# Altium schematic sheet Mosfet driver.SchDoc
size A4; SheetNumber: 2; SheetTotal: 2
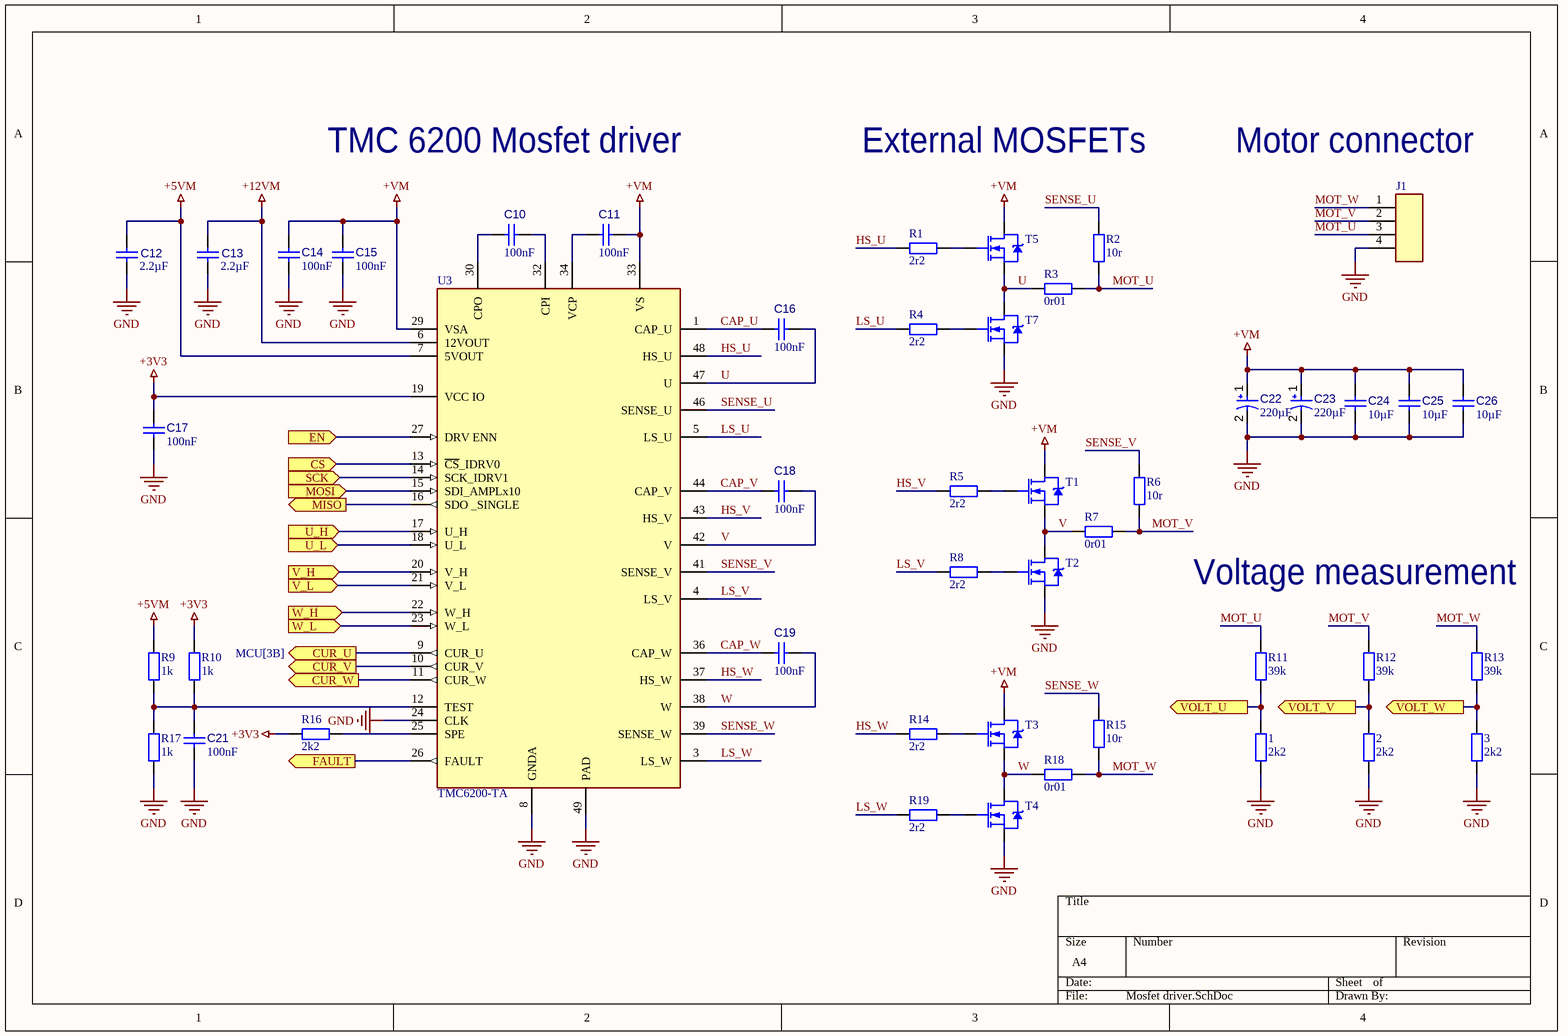
[diagram p0: Mosfet driver.SchDoc]

## Parts
1  value 2k2  [RESC1608X04M]  (hidden comment: R0603)
2  value 2k2  [RESC1608X04M]  (hidden comment: R0603)
3  value 2k2  [RESC1608X04M]  (hidden comment: R0603)
C10  value 100nF  [CAPC1608X90X40NL10T20]  (hidden comment: Capacitor 100 nF +/-10% 50 V 0603)
C11  value 100nF  [CAPC1608X90X40NL10T20]  (hidden comment: Capacitor 100 nF +/-10% 50 V 0603)
C12  value 2.2µF  [CAPC0805(2012)145_L]  (hidden comment: Capacitor 22µF +/-40% 16V 0805)
C13  value 2.2µF  [CAPC0805(2012)145_L]  (hidden comment: Capacitor 22µF +/-40% 16V 0805)
C14  value 100nF  [CAPC1608X90X40NL10T20]  (hidden comment: Capacitor 100 nF +/-10% 50 V 0603)
C15  value 100nF  [CAPC1608X90X40NL10T20]  (hidden comment: Capacitor 100 nF +/-10% 50 V 0603)
C16  value 100nF  [CAPC1608X90X40NL10T20]  (hidden comment: Capacitor 100 nF +/-10% 50 V 0603)
C17  value 100nF  [CAPC1608X90X40NL10T20]  (hidden comment: Capacitor 100 nF +/-10% 50 V 0603)
C18  value 100nF  [CAPC1608X90X40NL10T20]  (hidden comment: Capacitor 100 nF +/-10% 50 V 0603)
C19  value 100nF  [CAPC1608X90X40NL10T20]  (hidden comment: Capacitor 100 nF +/-10% 50 V 0603)
C21  value 100nF  [CAPC1608X90X40NL10T20]  (hidden comment: Capacitor 100 nF +/-10% 50 V 0603)
C22  value 220µF  [CAPPR55-250-1120X630X1220]  (hidden comment: ECA-1HM470)
C23  value 220µF  [CAPPR55-250-1120X630X1220]  (hidden comment: ECA-1HM470)
C24  value 10µF  [CAPC3216X180X50NL20T25]  (hidden comment: Capacitor 10 uF +/- 10% 16 V 1206)
C25  value 10µF  [CAPC3216X180X50NL20T25]  (hidden comment: Capacitor 10 uF +/- 10% 16 V 1206)
C26  value 10µF  [CAPC3216X180X50NL20T25]  (hidden comment: Capacitor 10 uF +/- 10% 16 V 1206)
J1  282837-4  [TE_282837-4]  (value not drawn)
R1  value 2r2  [RESC1608X04M]  (hidden comment: R0603)
R2  value 10r  [RESC1608X04M]  (hidden comment: R0603)
R3  value 0r01  [RESC6432X06M]  (hidden comment: R2512)
R4  value 2r2  [RESC1608X04M]  (hidden comment: R0603)
R5  value 2r2  [RESC1608X04M]  (hidden comment: R0603)
R6  value 10r  [RESC1608X04M]  (hidden comment: R0603)
R7  value 0r01  [RESC6432X06M]  (hidden comment: R2512)
R8  value 2r2  [RESC1608X04M]  (hidden comment: R0603)
R9  value 1k  [RESC1608X04M]  (hidden comment: R0603)
R10  value 1k  [RESC1608X04M]  (hidden comment: R0603)
R11  value 39k  [RESC1608X04M]  (hidden comment: R0603)
R12  value 39k  [RESC1608X04M]  (hidden comment: R0603)
R13  value 39k  [RESC1608X04M]  (hidden comment: R0603)
R14  value 2r2  [RESC1608X04M]  (hidden comment: R0603)
R15  value 10r  [RESC1608X04M]  (hidden comment: R0603)
R16  value 2k2  [RESC1608X04M]  (hidden comment: R0603)
R17  value 1k  [RESC1608X04M]  (hidden comment: R0603)
R18  value 0r01  [RESC6432X06M]  (hidden comment: R2512)
R19  value 2r2  [RESC1608X04M]  (hidden comment: R0603)
T1  BSC072N08NS5ATMA1  [FP-PG-TDSON-8-MFG]  (value not drawn)
T2  BSC072N08NS5ATMA1  [FP-PG-TDSON-8-MFG]  (value not drawn)
T3  BSC072N08NS5ATMA1  [FP-PG-TDSON-8-MFG]  (value not drawn)
T4  BSC072N08NS5ATMA1  [FP-PG-TDSON-8-MFG]  (value not drawn)
T5  BSC072N08NS5ATMA1  [FP-PG-TDSON-8-MFG]  (value not drawn)
T7  BSC072N08NS5ATMA1  [FP-PG-TDSON-8-MFG]  (value not drawn)
U3  TMC6200-TA  [TSQFP50P900X900X120_HS-49N]

## Ports
CS (in, see MCU[2C]), CUR_U (out, see MCU[3B]), CUR_V (out, see MCU[3B]), CUR_W (out, see MCU[3B]), EN (in, see MCU[2C]), FAULT (out, see MCU[2C]), MISO (out, see MCU[2C]), MOSI (in, see MCU[2C]), SCK (in, see MCU[2C]), U_H (in, see MCU[3C]), U_L (in, see MCU[3C]), V_H (in, see MCU[3C]), V_L (in, see MCU[3C]), VOLT_U (out, see MCU[3B]), VOLT_V (out, see MCU[3B]), VOLT_W (out, see MCU[3B]), W_H (in, see MCU[3B]), W_L (in, see MCU[2C])

## Nets
+3V3: C17.2 R10.1 R16.2 U3.19(VCC_IO)
+5VM: C12.1 R9.1 U3.7(5VOUT)
+12VM: C13.1 U3.6(12VOUT)
+VM: C11.1 C14.2 C15.2 C22.1 C23.1 C24.2 C25.2 C26.2 T1.5,_6,_7,_8,_9(D) T3.5,_6,_7,_8,_9(D) T5.5,_6,_7,_8,_9(D) U3.29(VSA) U3.33(VS)
GND: 1.1 2.1 3.1 C12.2 C13.2 C14.1 C15.1 C17.1 C21.1 C22.2 C23.2 C24.1 C25.1 C26.1 J1.4 R17.2 T2.1,_2,_3(S) T4.1,_2,_3(S) T7.1,_2,_3(S) U3.8(GNDA) U3.24(CLK) U3.49(PAD)
CAP_U: C16.2 U3.1(CAP_U)
CAP_V: C18.2 U3.44(CAP_V)
CAP_W: C19.2 U3.36(CAP_W)
CS: U3.13(~{CS}_IDRV0) ; port CS
CUR_U: U3.9(CUR_U) ; port CUR_U
CUR_V: U3.10(CUR_V) ; port CUR_V
CUR_W: U3.11(CUR_W) ; port CUR_W
EN: U3.27(DRV_ENN) ; port EN
FAULT: U3.26(FAULT) ; port FAULT
HS_U: R1.1 U3.48(HS_U)
HS_V: R5.1 U3.43(HS_V)
HS_W: R14.1 U3.37(HS_W)
LS_U: R4.1 U3.5(LS_U)
LS_V: R8.1 U3.4(LS_V)
LS_W: R19.1 U3.3(LS_W)
MISO: U3.16(SDO__SINGLE) ; port MISO
MOSI: U3.15(SDI_AMPLx10) ; port MOSI
MOT_U: J1.3 R2.1 R3.1 R11.2
MOT_V: J1.2 R6.1 R7.1 R12.2
MOT_W: J1.1 R13.2 R15.1 R18.1
SCK: U3.14(SCK_IDRV1) ; port SCK
SENSE_U: R2.2 U3.46(SENSE_U)
SENSE_V: R6.2 U3.41(SENSE_V)
SENSE_W: R15.2 U3.39(SENSE_W)
U: C16.1 R3.2 T5.1,_2,_3(S) T7.5,_6,_7,_8,_9(D) U3.47(U)
U_H: U3.17(U_H) ; port U_H
U_L: U3.18(U_L) ; port U_L
V: C18.1 R7.2 T1.1,_2,_3(S) T2.5,_6,_7,_8,_9(D) U3.42(V)
V_H: U3.20(V_H) ; port V_H
V_L: U3.21(V_L) ; port V_L
VOLT_U: 1.2 R11.1 ; port VOLT_U
VOLT_V: 2.2 R12.1 ; port VOLT_V
VOLT_W: 3.2 R13.1 ; port VOLT_W
W: C19.1 R18.2 T3.1,_2,_3(S) T4.5,_6,_7,_8,_9(D) U3.38(W)
W_H: U3.22(W_H) ; port W_H
W_L: U3.23(W_L) ; port W_L
NetC10_1: C10.1 U3.32(CPI)
NetC10_2: C10.2 U3.30(CPO)
NetC11_2: C11.2 U3.34(VCP)
NetC21_2: C21.2 R9.2 R10.2 R17.1 U3.12(TEST)
NetR1_2: R1.2 T5.4(G)
NetR4_2: R4.2 T7.4(G)
NetR5_2: R5.2 T1.4(G)
NetR8_2: R8.2 T2.4(G)
NetR14_2: R14.2 T3.4(G)
NetR16_1: R16.1 U3.25(SPE)
NetR19_2: R19.2 T4.4(G)

## Notes on the sheet
- TMC 6200 Mosfet driver
- External MOSFETs
- (near J1) Motor connector
- Voltage measurement

## Library data of the parts
1-3 R1 R2 R4-R6 R8-R17 R19 = CMP-009-00179-11: Resistor SMD 0603
C10 C11 C14-C19 C21 = CMP-001-00017-6: Chip Capacitor, 100 nF, +/- 10%, 50 V, 0603 (1608 Metric); Voltage Rating: 50V; Capacitor Type: Ceramic; Tolerance: 10%; Mounting Technology: SM; Max Operating Temperature: 125°C; RoHS Compliant: True; Pins: 2; Case/Package: 0603; Min Operating Temperature: -55°C
C12 C13 = CMP-001-00081-4: Chip Capacitor, 22µF +/-40%, 16V, 0805, Thickness 1.45 mm; Tolerance: 5%; Voltage Rating: 16V; Mounting Technology: SMT; Pins: 2; Max Operating Temperature: 85°C; Case/Package: 0805; Min Operating Temperature: -55°C
C22 C23 = CMP-001-00031-7: Aluminum Electrolytic Capacitor, 47 uF, +/-20%, 50 V, -40 to 85 degC, 2-Pin THD, RoHS, Bulk; Manufacturer: Panasonic; Ripple Current: 130mA; Voltage Rating: 50V; Tolerance: 20%; RoHS Compliant: True; Lead Pitch: 2.5mm; Packaging: Bulk; Case/Package: Radial; Diameter: 6.3mm; Datasheet Version: Apr-16; Mounting Technology: TH; Max Operating Temperature: 85°C; Package Quantity: 200; Package Description: 2-Pin Radial Lead, Dia 6.3 mm, Height 12.2 mm; Capacitor Type: Electrolytic; Min Operating Temperature: -40°C; Ripple Current (AC): 130mA; Manufacturer URL: http://www.panasonic.com/; Pins: 2; Datasheet URL: https://industrial.panasonic.com/cdbs/www-data/pdf/RDF0000/DMF0000COL72.pdf; Package Reference: CAPPR55-250-1120X630X1220
C24-C26 = CMP-001-00016-6: Chip Capacitor, 10 uF, +/- 10%, 16 V, 1206 (3216 Metric); Capacitor Type: Ceramic; Voltage Rating: 16V; Tolerance: 10%; Min Operating Temperature: -55°C; Pins: 2; Mounting Technology: SM; Case/Package: 1206; Max Operating Temperature: 125°C; RoHS Compliant: True
J1 = CMP-006-000000-5: 4 Position Wire to Board Terminal Block Horizontal with Board 0.200 (5.08mm) Through Hole; MF: TE Connectivity; Source: 282837-4.SchLib; EU_RoHS_Compliance: Compliant with Exemptions; MP: 282837-4; Purchase-URL: https://pricing.snapeda.com/search/part/282837-4/?ref=eda; Availability: In Stock; Price: None; Pin Count: 4; SnapEDA_Link: https://www.snapeda.com/parts/282837-4/TE+Connectivity+AMP+Connectors/view-part/?ref=snap; Package: None; Design Item ID: 282837-4; Check_prices: https://www.snapeda.com/parts/282837-4/TE+Connectivity+AMP+Connectors/view-part/?ref=eda; Component Type: Standard; Value: *
R3 R7 R18 = CMP-009-00181-2: Resistor SMD 2512
T1-T5 T7 = CMP-013-00034-5: Power Field-Effect Transistor, 19A I(D), 80V, 0.0072ohm, 1-Element, N-Channel, Silicon, Metal-oxide Semiconductor FET; Case Connection: DRAIN; Avalanche Energy Rating (Eas): 40mJ; Pins: 5; Drain Current-Max (ID): 19A; DS Breakdown Voltage-Min: 80V; RoHS Compliant: Yes
U3 = CMP-00024-00007-2: 48-TQFP-EP（7x7）